# EAGLE design Mega_Amp_2_6 (EAGLE 9.0.0)
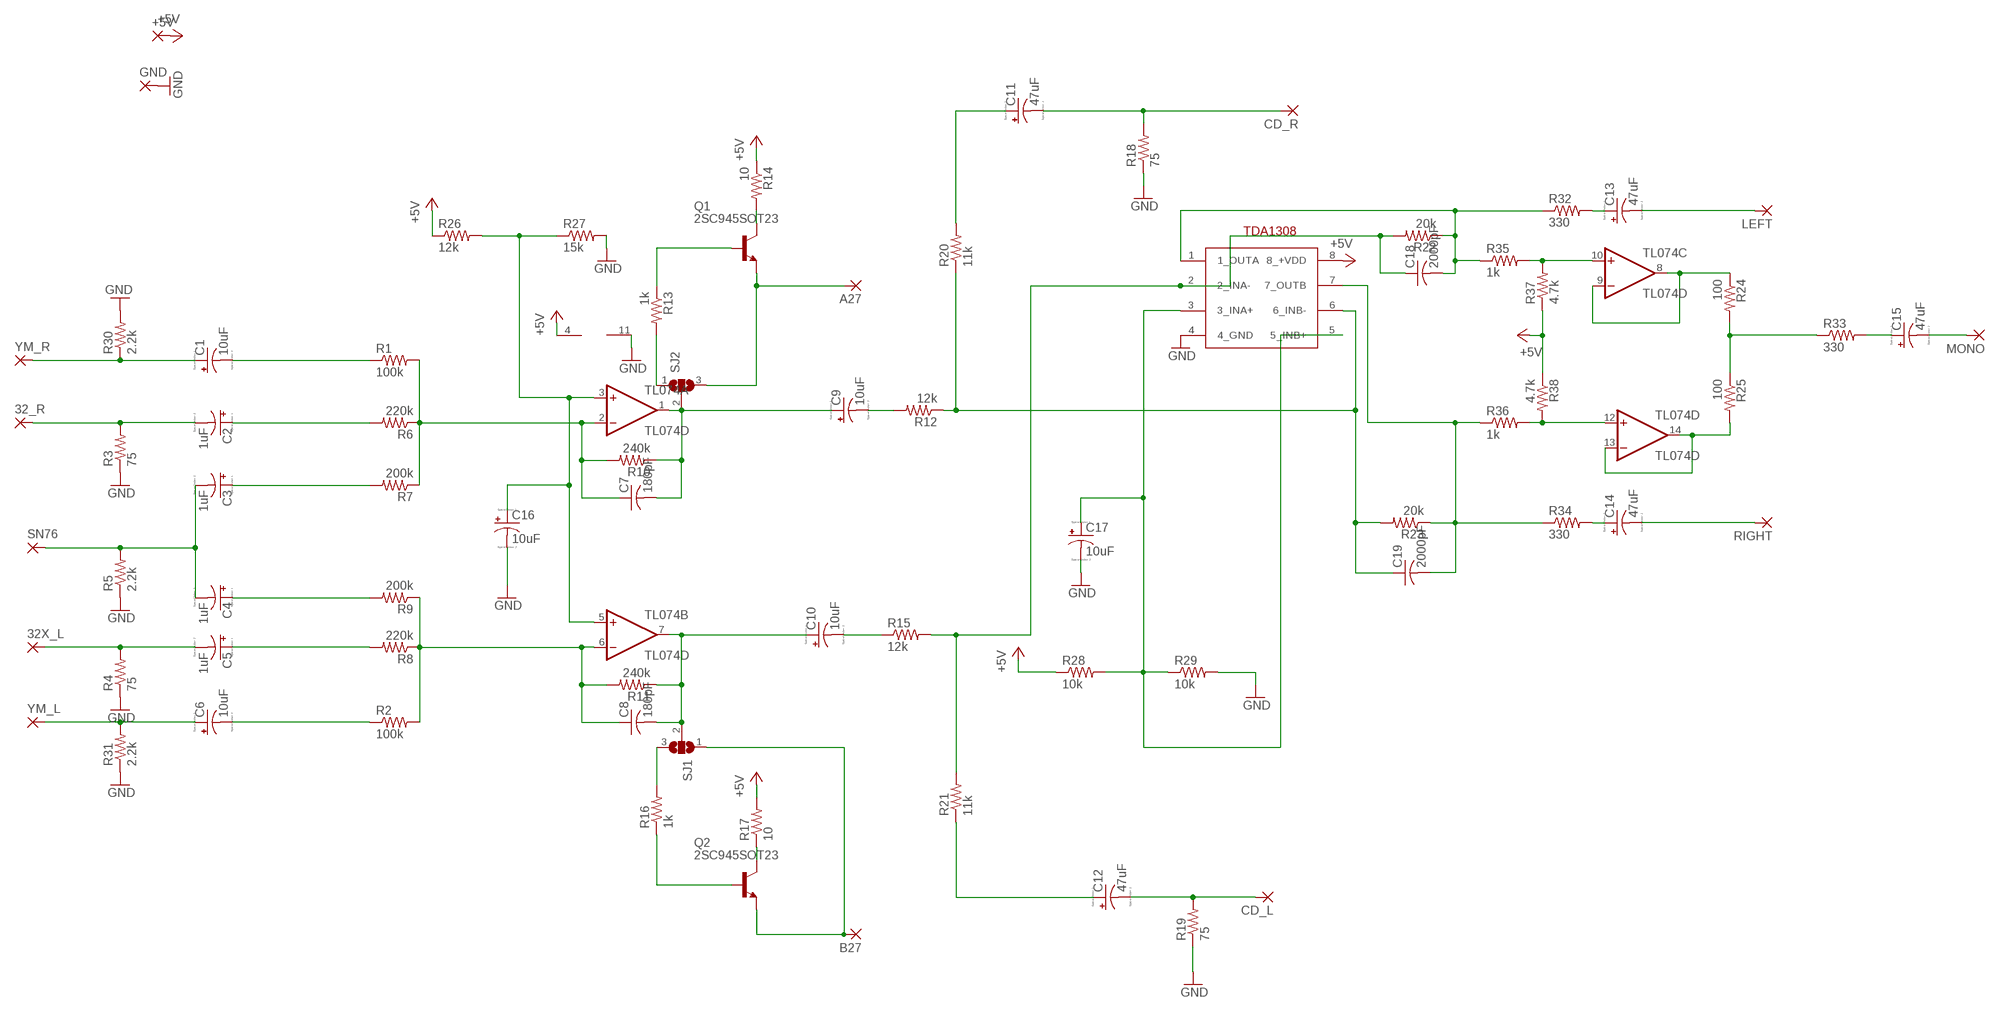
[diagram p0: schematic, sheet 1]

## Parts
32_R  SMD2  [SMD1,27-2,54]
32X_L  SMD2  [SMD1,27-2,54]
+5V  SMD5  [SMD2,54-5,08]
A27  SMD2  [SMD1,27-2,54]
B27  SMD2  [SMD1,27-2,54]
C1  10uF  CPOL-US153CLV-0405  [153CLV-0405]
C2  1uF  CPOL-US153CLV-0405  [153CLV-0405]
C3  1uF  CPOL-US153CLV-0405  [153CLV-0405]
C4  1uF  CPOL-US153CLV-0405  [153CLV-0405]
C5  1uF  CPOL-US153CLV-0405  [153CLV-0405]
C6  10uF  CPOL-US153CLV-0405  [153CLV-0405]
C7  180pF  C-USC0603  [C0603]
C8  180pF  C-USC0603  [C0603]
C9  10uF  CPOL-US153CLV-0405  [153CLV-0405]
C10  10uF  CPOL-US153CLV-0405  [153CLV-0405]
C11  47uF  CPOL-US153CLV-0505  [153CLV-0505]
C12  47uF  CPOL-US153CLV-0505  [153CLV-0505]
C13  47uF  CPOL-US153CLV-0505  [153CLV-0505]
C14  47uF  CPOL-US153CLV-0505  [153CLV-0505]
C15  47uF  CPOL-US153CLV-0505  [153CLV-0505]
C16  10uF  CPOL-US153CLV-0405  [153CLV-0405]
C17  10uF  CPOL-US153CLV-0405  [153CLV-0405]
C18  2000pF  C-USC0603  [C0603]
C19  2000pF  C-USC0603  [C0603]
CD_L  SMD2  [SMD1,27-2,54]
CD_R  SMD2  [SMD1,27-2,54]
GND  SMD5  [SMD2,54-5,08]
LEFT  SMD2  [SMD1,27-2,54]
MONO  SMD2  [SMD1,27-2,54]
Q1  2SC945SOT23  [SOT23]
Q2  2SC945SOT23  [SOT23]
R1  100k  R-US_R0603  [R0603]
R2  100k  R-US_R0603  [R0603]
R3  75  R-US_R0603  [R0603]
R4  75  R-US_R0603  [R0603]
R5  2.2k  R-US_R0603  [R0603]
R6  220k  R-US_R0603  [R0603]
R7  200k  R-US_R0603  [R0603]
R8  220k  R-US_R0603  [R0603]
R9  200k  R-US_R0603  [R0603]
R10  240k  R-US_R0603  [R0603]
R11  240k  R-US_R0603  [R0603]
R12  12k  R-US_R0603  [R0603]
R13  1k  R-US_R0603  [R0603]
R14  10  R-US_R0603  [R0603]
R15  12k  R-US_R0603  [R0603]
R16  1k  R-US_R0603  [R0603]
R17  10  R-US_R0603  [R0603]
R18  75  R-US_R0603  [R0603]
R19  75  R-US_R0603  [R0603]
R20  11k  R-US_R0603  [R0603]
R21  11k  R-US_R0603  [R0603]
R22  20k  R-US_R0603  [R0603]
R23  20k  R-US_R0603  [R0603]
R24  100  R-US_R0603  [R0603]
R25  100  R-US_R0603  [R0603]
R26  12k  R-US_R0603  [R0603]
R27  15k  R-US_R0603  [R0603]
R28  10k  R-US_R0603  [R0603]
R29  10k  R-US_R0603  [R0603]
R30  2.2k  R-US_R0603  [R0603]
R31  2.2k  R-US_R0603  [R0603]
R32  330  R-US_R0603  [R0603]
R33  330  R-US_R0603  [R0603]
R34  330  R-US_R0603  [R0603]
R35  1k  R-US_R0603  [R0603]
R36  1k  R-US_R0603  [R0603]
R37  4.7k  R-US_R0603  [R0603]
R38  4.7k  R-US_R0603  [R0603]
RIGHT  SMD2  [SMD1,27-2,54]
SJ1  SJ2W  [SJ_2]
SJ2  SJ2W  [SJ_2]
SN76  SMD2  [SMD1,27-2,54]
TDA1308  TDA1308SO8  [SO8]
TL074  TL074D  [SO14]
YM_L  SMD2  [SMD1,27-2,54]
YM_R  SMD2  [SMD1,27-2,54]

## Nets
+5V: +5V.1(P) R14.1 R17.2 R26.1 R28.1 R37.1 R38.1 TDA1308.8(8_+VDD) TL074.4(P:V+)
GND: C16.- C17.- GND.1(P) R3.1 R4.1 R5.1 R18.1 R19.1 R27.2 R29.2 R30.2 R31.1 TDA1308.4(4_GND) TL074.11(P:V-)
N$1: C1.+ R30.1 YM_R.1(P)
N$2: C1.- R1.1
N$3: 32_R.1(P) C2.- R3.2
N$4: C2.+ R6.2
N$5: C3.- C4.- R5.2 SN76.1(P)
N$6: C3.+ R7.2
N$7: C4.+ R9.2
N$8: C7.1 R1.2 R6.1 R7.1 R10.2 TL074.2(A:-IN)
N$9: C8.1 R2.2 R8.1 R9.1 R11.2 TL074.6(B:-IN)
N$10: C5.+ R8.2
N$11: C6.- R2.1
N$12: 32X_L.1(P) C5.- R4.2
N$13: C6.+ R31.2 YM_L.1(P)
N$14: C16.+ R26.2 R27.1 TL074.3(A:+IN) TL074.5(B:+IN)
N$15: C7.2 C9.+ R10.1 SJ2.2 TL074.1(A:OUT)
N$16: Q1.1(B) R13.1
N$17: C8.2 C10.+ R11.1 SJ1.2 TL074.7(B:OUT)
N$18: Q1.3(C) R14.2
N$19: A27.1(P) Q1.2(E) SJ2.3
N$20: C9.- R12.2
N$21: C19.1 R12.1 R20.1 R23.2 TDA1308.6(6_INB-)
N$22: C11.+ R20.2
N$23: C11.- CD_R.1(P) R18.2
N$24: C13.- LEFT.1(P)
N$25: C15.- MONO.1(P)
N$26: R24.2 R25.1 R33.1
N$27: C10.- R15.1
N$28: C17.+ R28.2 R29.1 TDA1308.3(3_INA+) TDA1308.5(5_INB+)
N$29: Q2.1(B) R16.1
N$30: Q2.3(C) R17.1
N$31: B27.1(P) Q2.2(E) SJ1.1
N$32: C12.+ R21.1
N$33: C12.- CD_L.1(P) R19.2
N$34: C18.1 R15.2 R21.2 R22.2 TDA1308.2(2_INA-)
N$35: R24.1 TL074.8(C:OUT) TL074.9(C:-IN)
N$36: R25.2 TL074.13(D:-IN) TL074.14(D:OUT)
N$37: C14.- RIGHT.1(P)
N$38: C13.+ R32.2
N$39: C14.+ R34.2
N$40: C15.+ R33.2
N$41: R13.2 SJ2.1
N$42: C19.2 R23.1 R34.1 R36.1 TDA1308.7(7_OUTB)
N$43: R16.2 SJ1.3
N$44: R35.2 R37.2 TL074.10(C:+IN)
N$45: C18.2 R22.1 R32.1 R35.1 TDA1308.1(1_OUTA)
N$46: R36.2 R38.2 TL074.12(D:+IN)

## Library data of the parts
32_R 32X_L A27 B27 CD_L CD_R LEFT MONO RIGHT SN76 YM_L YM_R = wirepad:SMD2: SMD PAD
+5V GND = wirepad:SMD5: SMD PAD
C1-C6 C9-C17 = resistor:CPOL-US: POLARIZED CAPACITOR, American symbol
C7 C8 C18 C19 = resistor:C-US: CAPACITOR, American symbol
Q1 Q2 = TRP_Custom:2SC945: NPN Transistor
R1-R38 = resistor:R-US_: RESISTOR, American symbol
SJ1 SJ2 = jumper:SJ2W: SMD solder JUMPER
TDA1308 = Audio-Power-amlifier:TDA1308
TL074 = linear:TL074: OP AMP

## Board
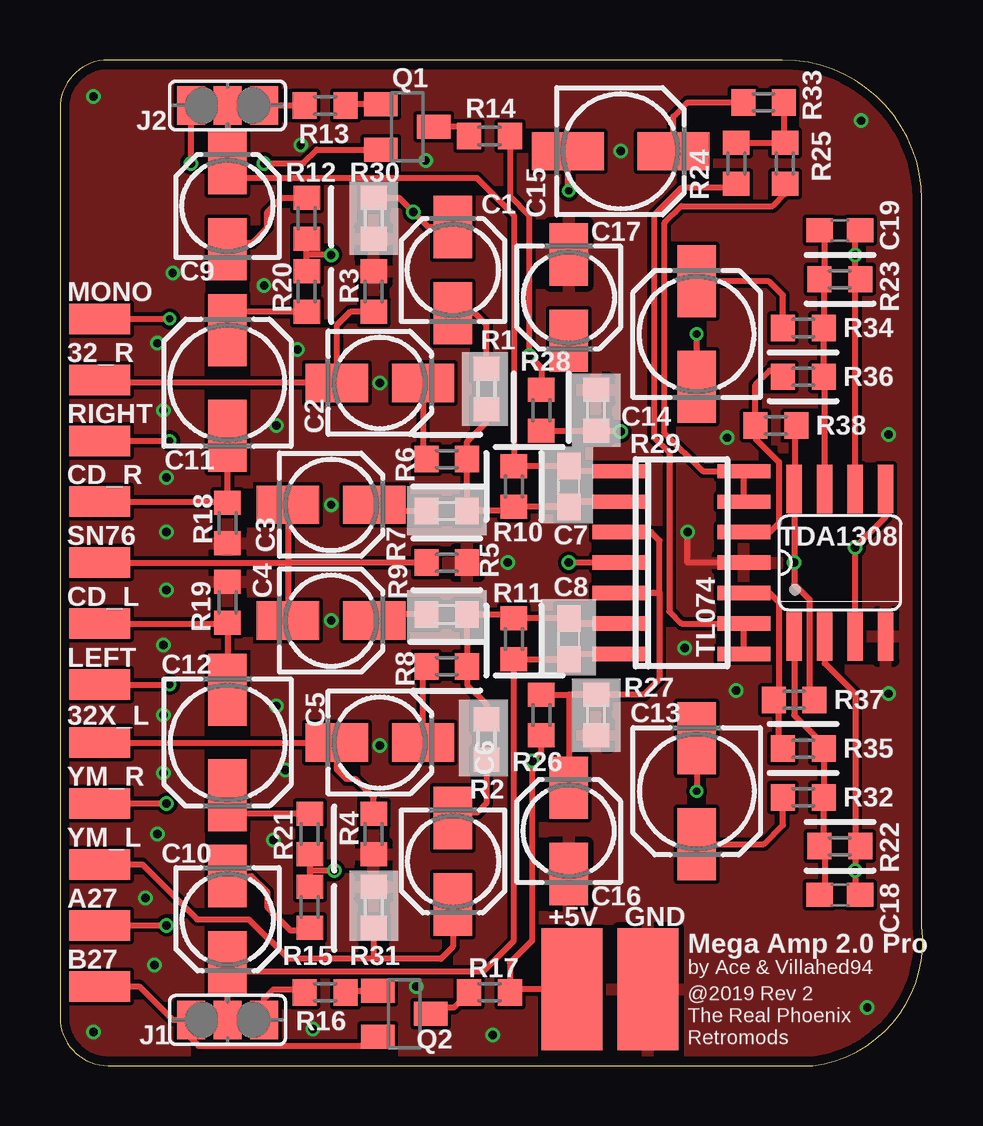
[diagram p1: board, top side]
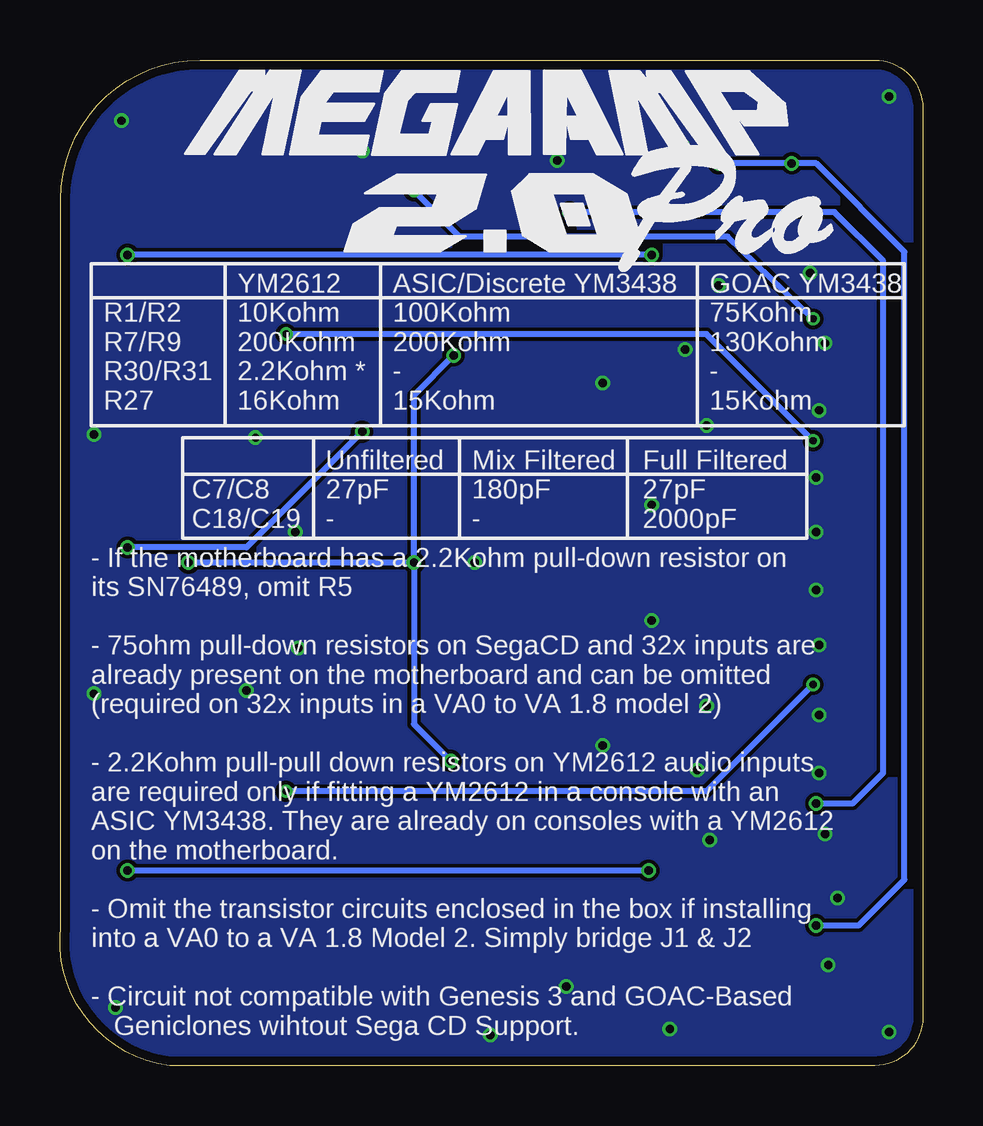
[diagram p2: board, bottom side, seen from below]

Size 35.97 x 41.9 mm. Coordinates in mm from the lower left corner, seen from the top.
Outline: 0,39.9 0,2 arc90 2,0 31.39,0 arc90 35.93,5.81 35.93,36.09 arc90 30.12,41.9 2,41.9 arc90 0,39.9
Copper layers (1*16): Top 0.035559375mm / dielectric 1.6mm / Bottom 0.035559375mm
Design rules "oshpark-2layer": minimum track width 6mil, minimum drill 10mil, track to track 6mil, track to pad 6mil, pad to pad 6mil, via to via 6mil, smd to smd 6mil, copper to edge 15mil, drill to drill 6mil, minimum pad ring 5mil, minimum via ring 5mil, stop-mask expansion 2.5mil, vias tented up to drill 0mil, thermal gap 10mil

### Footprints (pad centres in the part's own frame; a part is rotated, then mirrored left to right if it is on the bottom)
SMD1,27-2,54 = smd 1.27 x 2.54: 1 0,0
SMD2,54-5,08 = smd 2.54 x 5.08: 1 0,0
153CLV-0405 = smd 2.6 x 1.6: + 1.8,0; - -1.8,0
C0603 = smd 1.1 x 1: 1 -0.85,0; 2 0.85,0
153CLV-0505 = smd 3 x 1.6: + 2.2,0; - -2.2,0
SOT23 = smd 1 x 1.4: 1 -0.95,-1.1; 2 0.95,-1.1; 3 0,1.1
R0603 = smd 1 x 1.1: 1 -0.85,0; 2 0.85,0
SJ_2 = smd 1.168 x 1.6: 1 -1.524,0; 2 0,0; 3 1.524,0
SO8 = smd 0.66 x 2.032: 1 -1.905,-3.073; 2 -0.635,-3.073; 3 0.635,-3.073; 4 1.905,-3.073; 5 1.905,3.073; 6 0.635,3.073; 7 -0.635,3.073; 8 -1.905,3.073
SO14 = smd 0.6 x 2.2: 1 -3.81,-2.6; 2 -2.54,-2.6; 3 -1.27,-2.6; 4 0,-2.6; 5 1.27,-2.6; 6 2.54,-2.6; 7 3.81,-2.6; 8 3.81,2.6; 9 2.54,2.6; 10 1.27,2.6; 11 0,2.6; 12 -1.27,2.6; 13 -2.54,2.6; 14 -3.81,2.6

### Placement (x,y rotation side)
32_R  1.65,28.57 90 top
32X_L  1.65,13.46 90 top
+5V  21.34,3.17 0 top
A27  1.65,5.84 90 top
B27  1.65,3.3 90 top
C1  16.38,33.15 90 top
C2  13.34,28.45 0 top
C3  11.3,23.37 0 top
C4  11.3,18.54 0 top
C5  13.34,13.46 0 top
C6  16.38,8.51 270 top
C7  21.21,24.13 90 top
C8  21.21,17.78 270 top
C9  6.99,35.81 90 top
C10  6.99,6.1 270 top
C11  6.99,28.45 90 top
C12  6.99,13.46 270 top
C13  26.54,11.43 270 top
C14  26.54,30.48 90 top
C15  23.37,38.1 0 top
C16  21.21,9.78 90 top
C17  21.21,32 270 top
C18  32.51,7.11 180 top
C19  32.51,34.8 180 top
CD_L  1.65,18.41 90 top
CD_R  1.65,23.5 90 top
GND  24.51,3.17 180 top
LEFT  1.65,15.88 90 top
MONO  1.65,31.12 90 top
Q1  14.48,39.12 270 top
Q2  14.35,2.16 270 top
R1  17.78,28.19 270 top
R2  17.78,13.59 90 top
R3  13.08,32.26 270 top
R4  13.08,9.65 90 top
R5  16.13,20.96 180 top
R6  16.13,25.27 180 top
R7  16.13,23.11 180 top
R8  16.13,16.64 180 top
R9  16.13,18.8 180 top
R10  18.92,24.13 270 top
R11  18.92,17.78 90 top
R12  10.29,35.31 90 top
R13  11.05,40.01 180 top
R14  17.91,38.73 180 top
R15  10.41,6.6 90 top
R16  11.05,3.05 180 top
R17  17.91,3.05 0 top
R18  6.99,22.61 90 top
R19  6.99,19.3 270 top
R20  10.29,32.26 270 top
R21  10.41,9.65 270 top
R22  32.51,9.14 0 top
R23  32.51,32.77 0 top
R24  28.19,37.59 90 top
R25  30.23,37.59 270 top
R26  20.07,14.61 90 top
R27  22.35,14.61 270 top
R28  20.07,27.3 270 top
R29  22.35,27.3 90 top
R30  13.08,35.31 270 top
R31  13.08,6.6 270 top
R32  30.99,11.18 180 top
R33  29.34,40.13 180 top
R34  30.99,30.73 180 top
R35  30.99,13.21 180 top
R36  30.99,28.7 180 top
R37  30.61,15.24 180 top
R38  29.85,26.67 180 top
RIGHT  1.65,26.04 90 top
SJ1  6.99,1.91 0 top
SJ2  6.99,40.01 180 top
SN76  1.65,20.96 90 top
TDA1308  32.51,20.96 0 top
TL074  25.91,20.96 270 top
YM_L  1.65,8.38 90 top
YM_R  1.65,10.92 90 top

### Tracks (layer width: path | path; a pad name or v marks a point on that pad's centre or on a via)
+5V  (via drill 0.35)
  Top 0.254: TL074.4 v21.21,20.96 | R26.1 20.07,13.08 v19.68,12.7 19.68,5.21 18.76,4.28 R17.2 18.88,3.17 +5V.1 | R28.1 20.07,29.08 v19.56,29.59 19.56,35.43 18.76,36.23 R14.1 | R38.1 30.65,26.5 30.65,24.07 TDA1308.8 v30.61,20.96 30.61,20.07 31.24,19.43 31.24,15.46 R37.1
  Bottom 0.254: v19.56,29.59 21.21,27.94 v21.21,20.96 | v21.21,20.96 21.21,14.22 v19.68,12.7 | v21.21,20.96 v30.61,20.96
GND  (via drill 0.35)
  Top 0.254: TL074.11 26.16,20.96 v26.16,22.23
  other vias: 33.66,2.41 18.67,20.96 11.3,18.54 27.81,26.16 15.24,37.72 4.32,27.3 4.44,22.23 8.89,9.4 13.34,28.45 26.04,17.4 3.94,4.19 28.19,15.62 34.54,15.49 34.54,26.29 11.3,23.37 13.34,13.34 1.4,1.4 9.02,26.67 9.02,14.99 4.06,9.65 1.4,40.39 8.51,32.51 23.37,38.1 4.44,19.81 10.54,1.52 4.32,14.61 9.4,12.32 4.44,24.51 9.91,29.84 4.32,12.19 4.7,33.02 14.86,3.3 4.06,30.1 4.32,17.53 33.4,39.37 3.56,6.99 18.03,1.27 10.03,38.35
  pour Bottom (isolate 0.127): -0.89,43.18 37.21,43.18 37.21,-1.27 -0.89,-1.27
  pour Top (isolate 0.127): -0.89,43.18 37.21,43.18 37.21,-1.27 -0.89,-1.27
N$1  (via drill 0.35)
  Top 0.254: YM_R.1 v4.44,10.92 | R30.1 14.14,36.16 v14.73,35.56 15.34,34.95 C1.+
  Bottom 0.254: v4.44,10.92 2.92,10.92 1.65,12.19 1.65,33.53 3.68,35.56 v14.73,35.56
N$2
  Top 0.254: R1.1 17.78,30.86 17.29,31.35 C1.-
N$3
  Top 0.254: 11.41,28.57 C2.- | R3.2 12.1,31.41 11.54,30.84 C2.- | C2.- 1.78,28.45 32_R.1
N$4
  Top 0.254: C2.+ 15.13,25.42 R6.2
N$5
  Top 0.254: SN76.1 9.5,20.96 | C3.- 9.5,20.96 | 9.5,20.96 C4.- | R5.2 9.5,20.96
N$6
  Top 0.254: 15.18,23.18 R7.2 13.48,23.11 C3.+ 12.74,23.75
N$7
  Top 0.254: R9.2 13.21,18.8 13.25,18.16 C4.+
N$8
  Top 0.254: TL074.2 21.7,23.5 C7.1 R10.2 | 19.35,23.13 R10.2 | R10.2 19.24,23.11 R7.1 R6.1 16.98,26 17.78,26.8 R1.2
N$9
  Top 0.254: R9.1 R8.1 16.98,15.85 17.78,15.05 R2.2 | 19.35,18.78 R11.2 | 17.14,18.73 R9.1 | TL074.6 21.42,18.41 C8.1 R11.2 | R9.1 19.14,18.8 R11.2
N$10
  Top 0.254: C5.+ 15.13,16.49 R8.2
N$11
  Top 0.254: R2.1 17.78,10.92 17.4,10.54 16.49,10.54 C6.-
N$12
  Top 0.254: 11.41,13.21 C5.- | C5.- 11.54,12.34 11.94,11.94 12.32,11.94 13.08,11.18 R4.2 | 32X_L.1 C5.-
N$13
  Top 0.254: YM_L.1 3.43,8.38 5.72,6.1 7.87,6.1 9.52,4.45 13.08,4.45 | C6.+ 16.38,4.95 15.88,4.45 13.08,4.45 | R31.2 13.08,4.45
N$14
  Top 0.254: TL074.3 24.64,22.23 24.99,21.87 24.99,19.71 | TL074.5 24.73,19.71 24.99,19.71 | 21.21,15.46 R27.1 24.34,15.46 24.99,16.1 24.99,19.71 | R26.2 21.21,15.46 | 21.21,15.46 C16.+
N$15
  Top 0.254: TL074.1 21.57,24.77 C7.2 19,24.98 18.97,25.13 R10.1 18.92,35.43 17.38,36.98 7.73,36.98 7.2,37.5 7.08,37.5 C9.+ SJ2.2
N$16
  Top 0.254: 13.32,40.13 Q1.1 11.96,40.07 R13.1
N$17
  Top 0.254: TL074.7 21.57,17.14 C8.2 R11.1 18.92,5.21 17.63,3.91 7.37,3.91 C10.+ SJ1.2
N$18
  Top 0.254: Q1.3 16.68,39.12 R14.2
N$19  (via drill 0.35)
  Top 0.254: A27.1 v4.44,5.84 | v8.51,37.59 10.14,37.59 10.71,38.17 Q1.2 | v5.46,37.59 SJ2.3
  Bottom 0.254: v4.44,5.84 2.67,5.84 0.76,7.75 0.76,33.91 4.44,37.59 v5.46,37.59 v8.51,37.59
N$20
  Top 0.254: C9.- 7.26,34.29 8,34.29 8.64,34.93 8.64,35.56 9.23,36.16 R12.2
N$21  (via drill 0.35)
  Top 0.254: R20.1 10.29,33.78 | 10.29,33.78 R12.1 | v11.3,33.78 10.29,33.78 | TDA1308.6 33.15,32.8 R23.2 33.15,33.23 v33.15,33.78 33.15,34.84 C19.1
  Bottom 0.254: v11.3,33.78 v33.15,33.78
N$22
  Top 0.254: 7.49,30.73 6.9,30.73 C11.+ 7.49,31.41 R20.2
N$23
  Top 0.254: C11.- R18.2 6.77,23.5 CD_R.1
N$24  (via drill 0.3)
  Top 0.254: LEFT.1 v4.57,15.88 | C13.- v26.54,11.43
  Bottom 0.254: v4.57,15.88 9.02,11.43 v26.54,11.43
N$25  (via drill 0.3)
  Top 0.254: MONO.1 v4.57,31.12 | v21.21,36.45 21.17,36.49 C15.-
  Bottom 0.254: v4.57,31.12 8.13,34.54 19.3,34.54 v21.21,36.45
N$26
  Top 0.254: R24.2 R25.1 30.19,38.48 R33.1
N$27
  Top 0.254: R15.1 10.16,5.72 10.19,5.62 9.62,5.62 8.64,6.6 8.64,7.24 7.98,7.9 C10.-
N$28  (via drill 0.35)
  Top 0.254: TDA1308.5 34.42,22.86 v33.15,21.59 TDA1308.3 | v23.37,26.42 23.33,26.46 R29.1 21.21,26.46 | R28.2 21.21,26.46 | C17.+ 21.21,26.46
  Bottom 0.254: v23.37,26.42 28.19,21.59 v33.15,21.59
N$29
  Top 0.254: R16.1 12.34,3.11 Q2.1
N$30
  Top 0.254: R17.1 16.42,2.41 15.7,2.41 Q2.3
N$31
  Top 0.254: B27.1 3.3,3.3 4.7,1.91 SJ1.1 5.46,1.14 5.78,0.83 12.87,0.83 Q2.2
N$32
  Top 0.254: R21.1 6.98,10.5 C12.+
N$33
  Top 0.254: C12.- R19.2 6.77,18.41 CD_L.1
N$34  (via drill 0.35)
  Top 0.254: R21.2 10.41,8.13 | 10.41,8.13 R15.2 | v11.43,8.13 10.41,8.13 | TDA1308.2 31.88,16.76 33.15,15.49 33.15,9.23 R22.2 33.15,8.68 v33.15,8.13 33.15,7.07 C18.1
  Bottom 0.254: v11.43,8.13 v33.15,8.13
N$35
  Top 0.254: 28.25,17.09 28.19,17.14 TL074.8 TL074.9 25.91,18.41 25.4,18.92 25.4,25.53 24.76,26.16 24.76,35.43 25.91,36.58 28.19,36.58 R24.1
N$36
  Top 0.254: TL074.13 TL074.14 26.8,24.77 25.21,26.35 25.21,35.11 25.91,35.81 29.72,35.81 30.23,36.32 R25.2
N$37  (via drill 0.3)
  Top 0.254: RIGHT.1 v4.57,26.04 | C14.- v26.54,30.48
  Bottom 0.254: v26.54,30.48 9.02,30.48 v4.57,26.04
N$38
  Top 0.254: R32.2 30.14,10.03 29.33,9.23 C13.+
N$39
  Top 0.254: R34.2 30.14,32.09 29.55,32.68 C14.+
N$40
  Top 0.254: C15.+ 25.57,39.54 26.16,40.13 R33.2
N$41
  Top 0.254: SJ2.1 R13.2
N$42
  Top 0.254: 31.84,32.84 R23.1 | R23.1 31.66,32.93 31.88,33.27 31.88,34.84 C19.2 | TDA1308.7 31.88,28.66 R36.1 R34.1 31.84,32.59 R23.1
N$43
  Top 0.254: SJ1.3 8.51,2.79 8.89,3.17 9.82,3.17 R16.2
N$44
  Top 0.254: TL074.10 29.59,19.69 29.97,19.3 29.97,15.2 29.8,15.03 | 29.8,15.03 R37.2 | R35.2 29.97,13.12 29.97,14.86 29.8,15.03
N$45
  Top 0.254: TDA1308.1 30.61,14.61 31.84,13.37 R35.1 R32.1 31.84,8.94 31.79,8.89 R22.1 | 31.46,8.94 R22.1 | R22.1 31.66,9.23 31.88,9.02 31.88,7.07 C18.2
N$46
  Top 0.254: TL074.12 29.59,22.23 29.97,22.61 29.97,25.15 29,26.12 R38.2 29,28.36 29.59,28.96 R36.2

### Text on the board
tNames: J2 | Mega Amp 2.0 Pro | by Ace & Villahed94 | J1 | @2019 Rev 2 / The Real Phoenix / Retromods
bNames: GOAC YM3438 / 75Kohm / 130Kohm / - / 15Kohm | ASIC/Discrete YM3438 / 100Kohm / 200Kohm / - / 15Kohm | YM2612 / 10Kohm / 200Kohm / 2.2Kohm * / 16Kohm | R1/R2 / R7/R9 / R30/R31 / R27 | Full Filtered / 27pF / 2000pF | Mix Filtered / 180pF / - | Unfiltered / 27pF / - | C7/C8 / C18/C19 | - If the motherboard has a 2.2Kohm pull-down resistor on / its SN76489, omit R5 / / - 75ohm pull-down resistors on SegaCD and 32x inputs are / already present on the motherboard and can be omitted / (required on 32x inputs in a VA0 to VA 1.8 model 2) / / - 2.2Kohm pull-pull down resistors on YM2612 audio inputs / are required only if fitting a YM2612 in a console with an / ASIC YM3438. They are already on consoles with a YM2612 / on the motherboard. / / - Omit the transistor circuits enclosed in the box if installing / into a VA0 to a VA 1.8 Model 2. Simply bridge J1 & J2 / / - Circuit not compatible with Genesis 3 and GOAC-Based / Geniclones wihtout Sega CD Support.